# Altium schematic sheet Arduino.SchDoc
size A3; Organization: MCI; SheetNumber: 1; SheetTotal: 1
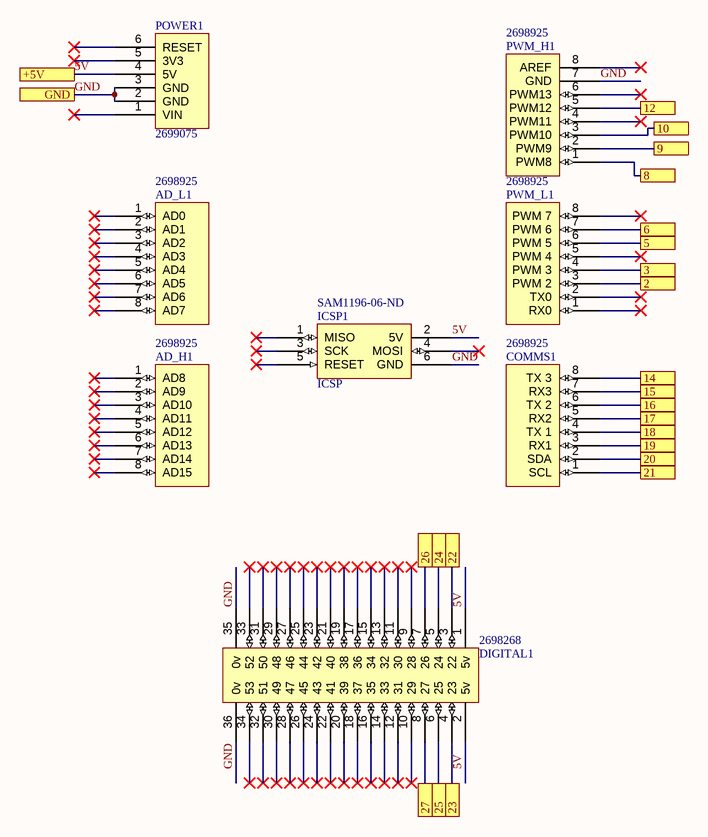
[diagram p0: Arduino.SchDoc]

## Parts
AD_H1  Supplier Part Number 4: 2698925  [Header 8x1 8.5mm]  (hidden comment: AD_H)
AD_L1  Supplier Part Number 5: 2698925  [Header 8x1 8.5mm]  (hidden comment: AD_L)
COMMS1  Supplier Part Number 4: 2698925  [Header 8x1 8.5mm]  (hidden comment: Communication)
DIGITAL1  Supplier Part Number 5: 2698268  [HEADER 36X 8MM]  (hidden comment: IO_36)
ICSP1  ICSP  Supplier Part Number 5: SAM1196-06-ND  [ICSP]
POWER1  Supplier Part Number 2: 2699075  [Header 6x1 8.5mm]  (hidden comment: POWER)
PWM_H1  Supplier Part Number 4: 2698925  [Header 8x1 8.5mm]  (hidden comment: PWM_H)
PWM_L1  Supplier Part Number 4: 2698925  [Header 8x1 8.5mm]  (hidden comment: PWM_L)

## Ports
2, 3, 5, 6, 8, 9, 10, 12, 14, 15, 16, 17, 18, 19, 20, 21, 22, 23, 24, 25, 26, 27, +5V, GND

## Nets
2: PWM_L1.3(PWM_2) ; port 2
3: PWM_L1.4(PWM_3) ; port 3
5: PWM_L1.6(PWM_5) ; port 5
5V: DIGITAL1.1(5v) DIGITAL1.2(5v) ICSP1.2(5V) POWER1.4(5V) ; port +5V
6: PWM_L1.7(PWM_6) ; port 6
8: PWM_H1.1(PWM8) ; port 8
9: PWM_H1.2(PWM9) ; port 9
10: PWM_H1.3(PWM10) ; port 10
12: PWM_H1.5(PWM12) ; port 12
14: COMMS1.8(TX_3) ; port 14
15: COMMS1.7(RX3) ; port 15
16: COMMS1.6(TX_2) ; port 16
17: COMMS1.5(RX2) ; port 17
18: COMMS1.4(TX_1) ; port 18
19: COMMS1.3(RX1) ; port 19
20: COMMS1.2(SDA) ; port 20
21: COMMS1.1(SCL) ; port 21
22: DIGITAL1.3(22) ; port 22
23: DIGITAL1.4(23) ; port 23
24: DIGITAL1.5(24) ; port 24
25: DIGITAL1.6(25) ; port 25
26: DIGITAL1.7(26) ; port 26
27: DIGITAL1.8(27) ; port 27
GND: DIGITAL1.35(0v) DIGITAL1.36(0v) ICSP1.6(GND) POWER1.2(GND) POWER1.3(GND) PWM_H1.7(GND) ; port GND

Not connected (* = marked no-connect by the designer): AD_H1 1(AD8)* 2(AD9)* 3(AD10)* 4(AD11)* 5(AD12)* 6(AD13)* 7(AD14)* 8(AD15)*; AD_L1 1(AD0)* 2(AD1)* 3(AD2)* 4(AD3)* 5(AD4)* 6(AD5)* 7(AD6)* 8(AD7)*; DIGITAL1 9(28)* 10(29)* 11(30)* 12(31)* 13(32)* 14(33)* 15(34)* 16(35)* 17(36)* 18(37)* 19(38)* 20(39)* 21(40)* 22(41)* 23(42)* 24(43)* 25(44)* 26(45)* 27(46)* 28(47)* 29(48)* 30(49)* 31(50)* 32(51)* 33(52)* 34(53)*; ICSP1 1(MISO)* 3(SCK)* 4(MOSI)* 5(RESET)*; POWER1 1(VIN)* 5(3V3)* 6(RESET)*; PWM_H1 4(PWM11)* 6(PWM13)* 8(AREF)*; PWM_L1 1(RX0)* 2(TX0)* 5(PWM_4)* 8(PWM_7)*

## Notes on the sheet
- Project
- Date:
- Drawn by:
- Time:
- Number:
- Revision:
- Sheet
- of
- ELECTRONICS
- File:

## Library data of the parts
AD_H1 = AD_H: Supplier 1: Arrow; Supplier Part Number 1: 2698940; Supplier 2: Arrow; Supplier Part Number 2: 2698939; Supplier 3: Digi-Key; Supplier Part Number 3: SAM1198-08-ND; Supplier 4: Arrow
AD_L1 = AD_L: Supplier 1: Digi-Key; Supplier Part Number 1: SAM1198-08-ND; Supplier 2: Arrow; Supplier Part Number 2: 2698939; Supplier 3: Arrow; Supplier Part Number 3: 2698940; Supplier 4: Arrow; Supplier Part Number 4: 43085273; Supplier 5: Arrow
COMMS1 = Communication: Supplier 1: Digi-Key; Supplier Part Number 1: SAM1198-08-ND; Supplier 2: Arrow; Supplier Part Number 2: 2698940; Supplier 3: Arrow; Supplier Part Number 3: 2698939; Supplier 4: Arrow
DIGITAL1 = IO_36: Supplier 1: Digi-Key; Supplier Part Number 1: SAM1196-18-ND; Supplier 2: Arrow; Supplier Part Number 2: 48117090; Supplier 3: Arrow; Supplier Part Number 3: 46093326; Supplier 4: Arrow; Supplier Part Number 4: 2698278; Supplier 5: Arrow
ICSP1 = ICSP: Supplier 1: Digi-Key; Supplier Part Number 1: SAM1185-06-ND; Supplier 2: Arrow; Supplier Part Number 2: 2699117; Supplier 3: Arrow; Supplier Part Number 3: 43862781; Supplier 4: Arrow; Supplier Part Number 4: 2699091; Supplier 5: Digi-Key
POWER1 = POWER: Supplier 1: Arrow; Supplier Part Number 1: 52553843; Supplier 2: Arrow; Supplier 3: Digi-Key; Supplier Part Number 3: SAM1198-06-ND; Supplier 4: Arrow; Supplier Part Number 4: 2699089; Supplier 5: Arrow; Supplier Part Number 5: 2699088
PWM_H1 = PWM_H: Supplier 1: Digi-Key; Supplier Part Number 1: SAM1198-08-ND; Supplier 2: Arrow; Supplier Part Number 2: 2698940; Supplier 3: Arrow; Supplier Part Number 3: 2698939; Supplier 4: Arrow
PWM_L1 = PWM_L: Supplier 1: Arrow; Supplier Part Number 1: 2698940; Supplier 2: Arrow; Supplier Part Number 2: 2698939; Supplier 3: Digi-Key; Supplier Part Number 3: SAM1198-08-ND; Supplier 4: Arrow